# EAGLE design 7seg (EAGLE 4.16)
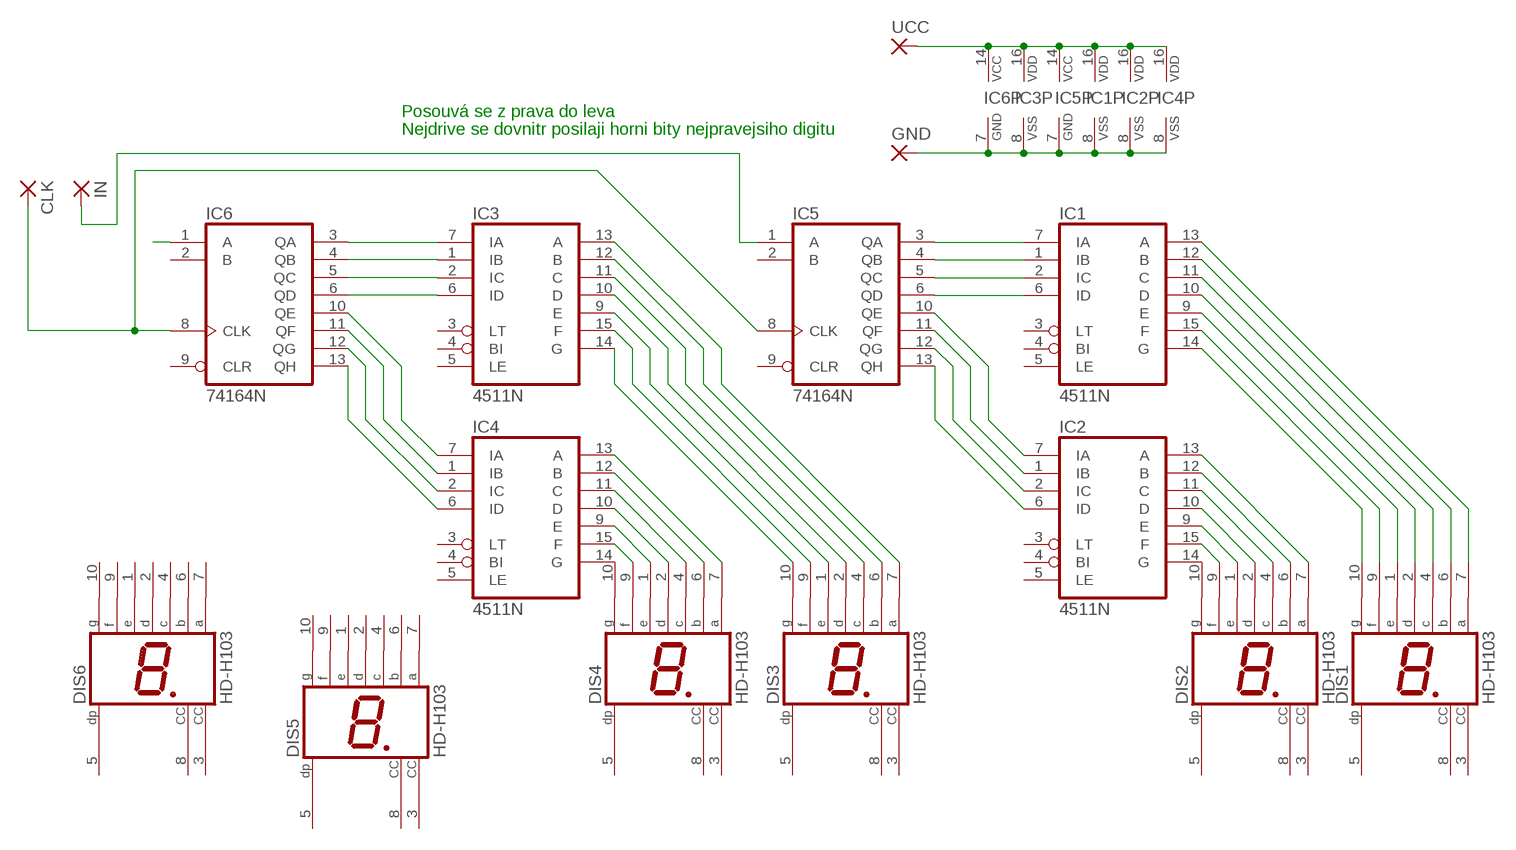
[diagram p0: schematic, sheet 1]

## Parts
CLK  2,54/0,8  [2,54/0,8]
DIS1  HD-H103  [HDSP-M]
DIS2  HD-H103  [HDSP-M]
DIS3  HD-H103  [HDSP-M]
DIS4  HD-H103  [HDSP-M]
DIS5  HD-H103  [HDSP-M]
DIS6  HD-H103  [HDSP-M]
GND  2,54/0,8  [2,54/0,8]
IC1  4511N  [DIL16]
IC2  4511N  [DIL16]
IC3  4511N  [DIL16]
IC4  4511N  [DIL16]
IC5  74164N  [DIL14]
IC6  74164N  [DIL14]
IN  2,54/0,8  [2,54/0,8]
UCC  2,54/0,8  [2,54/0,8]

## Nets
N$1: DIS2.10(G) IC2.14(G)
N$2: DIS2.9(F) IC2.15(F)
N$3: DIS2.1(E) IC2.9(E)
N$4: DIS2.2(D) IC2.10(D)
N$5: DIS2.4(C) IC2.11(C)
N$6: DIS2.6(B) IC2.12(B)
N$7: DIS2.7(A) IC2.13(A)
N$8: DIS1.10(G) IC1.14(G)
N$9: DIS1.9(F) IC1.15(F)
N$10: DIS1.1(E) IC1.9(E)
N$11: DIS1.2(D) IC1.10(D)
N$12: DIS1.4(C) IC1.11(C)
N$13: DIS1.7(A) IC1.13(A)
N$14: DIS1.6(B) IC1.12(B)
N$15: IC1.7(IA) IC5.3(QA)
N$16: IC1.1(IB) IC5.4(QB)
N$17: IC1.2(IC) IC5.5(QC)
N$18: IC1.6(ID) IC5.6(QD)
N$19: IC2.7(IA) IC5.10(QE)
N$20: IC2.1(IB) IC5.11(QF)
N$21: IC2.2(IC) IC5.12(QG)
N$22: IC2.6(ID) IC5.13(QH)
N$23: DIS4.10(G) IC4.14(G)
N$24: DIS4.9(F) IC4.15(F)
N$25: DIS4.1(E) IC4.9(E)
N$26: DIS4.2(D) IC4.10(D)
N$27: DIS4.4(C) IC4.11(C)
N$28: DIS4.6(B) IC4.12(B)
N$29: DIS4.7(A) IC4.13(A)
N$30: DIS3.10(G) IC3.14(G)
N$31: DIS3.9(F) IC3.15(F)
N$32: DIS3.1(E) IC3.9(E)
N$33: DIS3.2(D) IC3.10(D)
N$34: DIS3.4(C) IC3.11(C)
N$35: DIS3.6(B) IC3.12(B)
N$36: DIS3.7(A) IC3.13(A)
N$37: IC3.7(IA) IC6.3(QA)
N$38: IC3.1(IB) IC6.4(QB)
N$39: IC3.2(IC) IC6.5(QC)
N$40: IC3.6(ID) IC6.6(QD)
N$41: IC4.7(IA) IC6.10(QE)
N$42: IC4.1(IB) IC6.11(QF)
N$43: IC4.2(IC) IC6.12(QG)
N$44: IC4.6(ID) IC6.13(QH)
N$45: CLK.1(P) IC5.8(CLK) IC6.8(CLK)
N$46: IC6.1(A)
N$47: IC5.1(A) IN.1(P)
N$48: IC1.16(VDD) IC2.16(VDD) IC3.16(VDD) IC4.16(VDD) IC5.14(VCC) IC6.14(VCC) UCC.1(P)
N$49: GND.1(P) IC1.8(VSS) IC2.8(VSS) IC3.8(VSS) IC4.8(VSS) IC5.7(GND) IC6.7(GND)
Unconnected: DIS1.3(CC) DIS1.5(DP) DIS1.8(CC) DIS2.3(CC) DIS2.5(DP) DIS2.8(CC) DIS3.3(CC) DIS3.5(DP) DIS3.8(CC) DIS4.3(CC) DIS4.5(DP) DIS4.8(CC) DIS5.1(E) DIS5.2(D) DIS5.3(CC) DIS5.4(C) DIS5.5(DP) DIS5.6(B) DIS5.7(A) DIS5.8(CC) DIS5.9(F) DIS5.10(G) DIS6.1(E) DIS6.2(D) DIS6.3(CC) DIS6.4(C) DIS6.5(DP) DIS6.6(B) DIS6.7(A) DIS6.8(CC) DIS6.9(F) DIS6.10(G) IC1.3(LT) IC1.4(BI) IC1.5(LE) IC2.3(LT) IC2.4(BI) IC2.5(LE) IC3.3(LT) IC3.4(BI) IC3.5(LE) IC4.3(LT) IC4.4(BI) IC4.5(LE) IC5.2(B) IC5.9(CLR) IC6.2(B) IC6.9(CLR)

## Notes on the sheet
- Posouvá se z prava do leva
- Nejdrive se dovnitr posilaji horni bity nejpravejsiho digitu

## Library data of the parts
CLK GND IN UCC = wirepad:2,54/0,8: THROUGH-HOLE PAD
DIS1-DIS6 = display-hp:HD-H103: LED DISPLAY 1-character 7 segment, decimal point right
IC1-IC4 = 45xx:4511: BCD to 7-segment LATCH/DECODER/DRIVER
IC5 IC6 = 74xx-eu:74*164: 8-bit parallel out SHIFT REGISTER

## Board
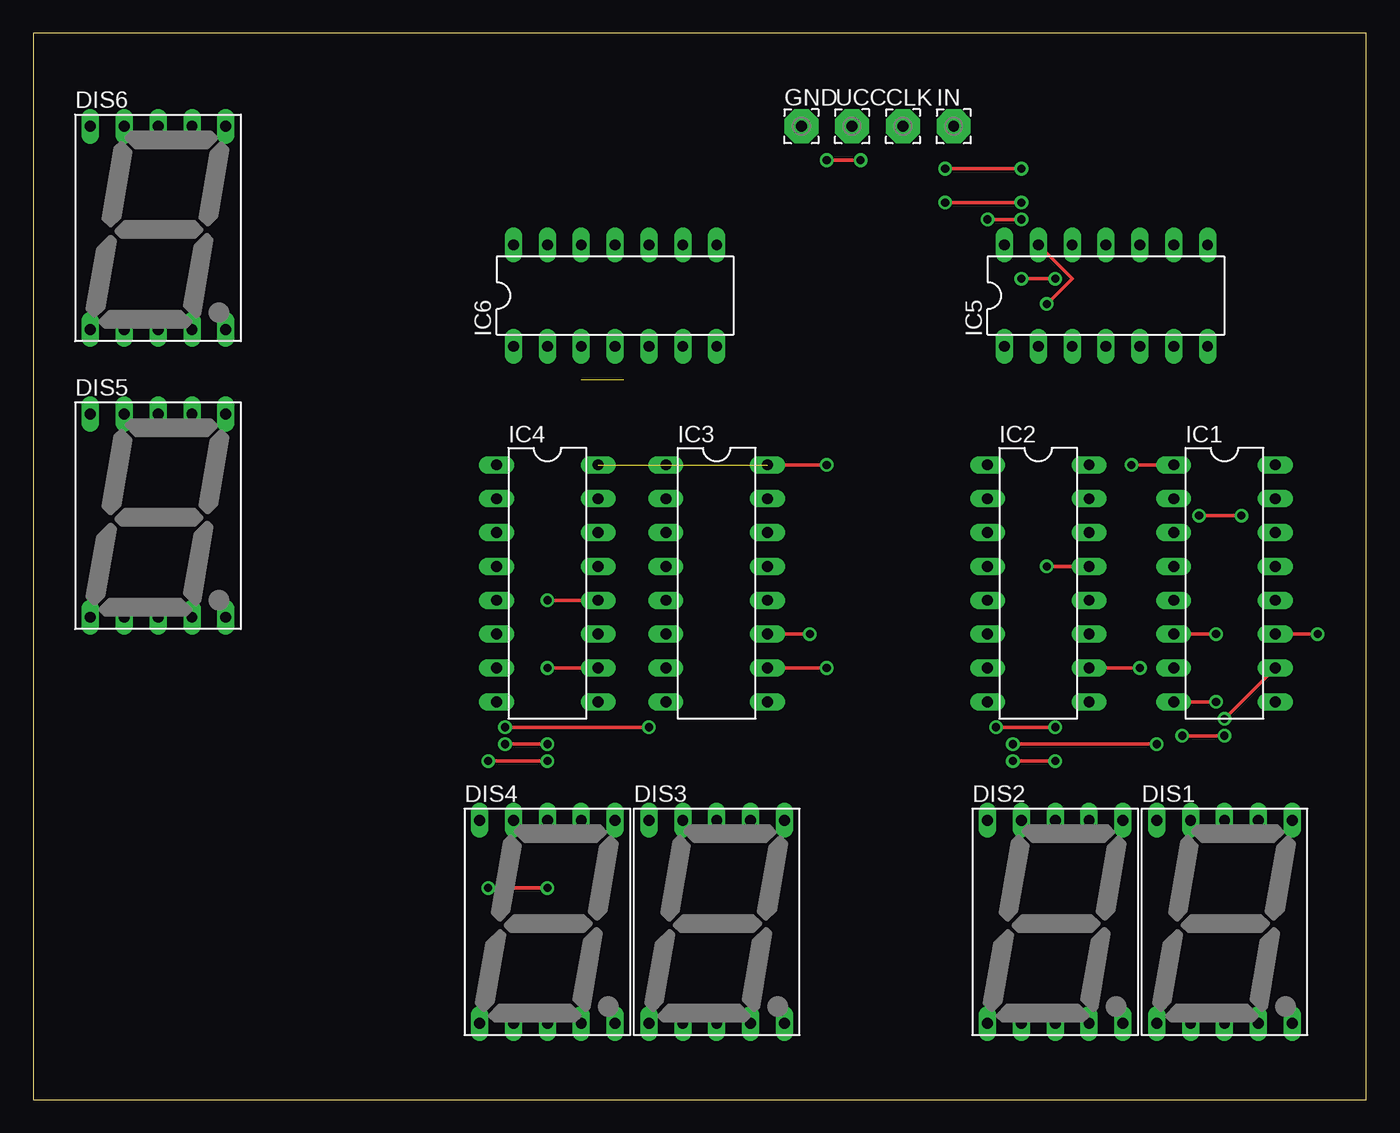
[diagram p1: board, top side]
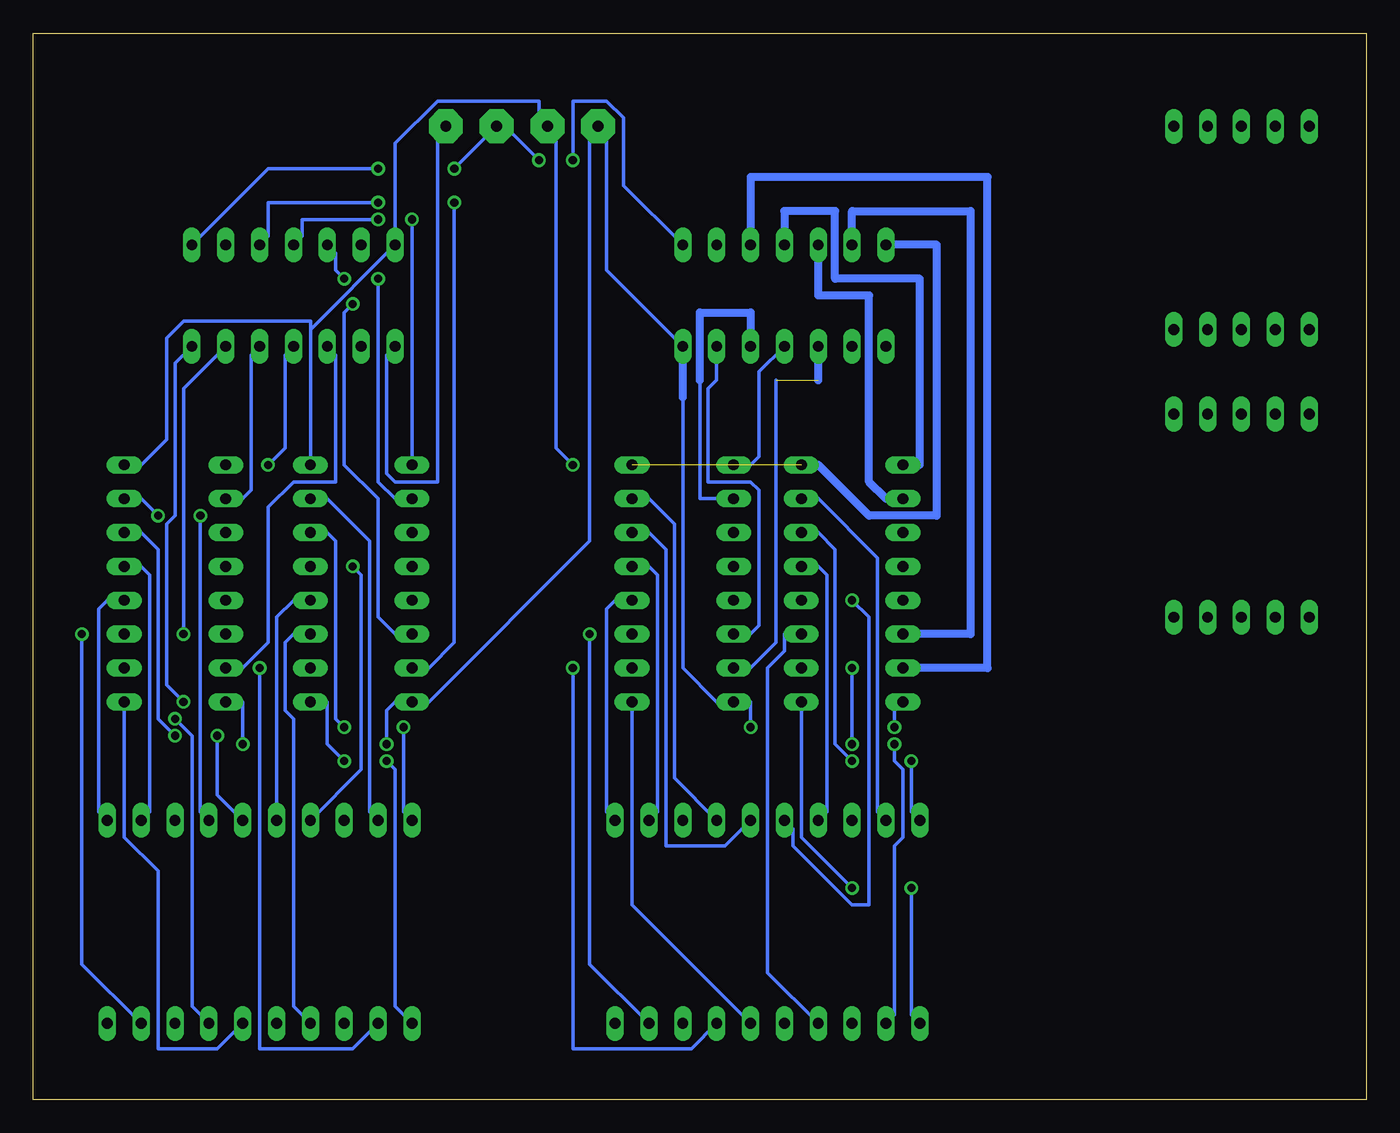
[diagram p2: board, bottom side, seen from below]

Size 100 x 80 mm. Coordinates in mm from the lower left corner, seen from the top.
Outline: 0,0 100,0 100,80 0,80 0,0
Copper layers (1*16): Top 0.035mm / dielectric 1.5mm / Bottom 0.035mm
Design rules "default": minimum track width 10mil, minimum drill 24mil, track to track 8mil, track to pad 8mil, pad to pad 8mil, via to via 8mil, smd to smd 8mil, copper to edge 40mil, drill to drill 8mil, minimum pad ring 10mil, minimum via ring 8mil, stop-mask expansion 4mil, vias tented up to drill 0mil, thermal gap 10mil

### Footprints (pad centres in the part's own frame; a part is rotated, then mirrored left to right if it is on the bottom)
2,54/0,8 = drill 0.813 pad 2.54 octagon: 1 0,0
HDSP-M = drill 0.813 long: 1 -5.08,-7.62; 2 -2.54,-7.62; 3 0,-7.62; 4 2.54,-7.62; 5 5.08,-7.62; 6 5.08,7.62; 7 2.54,7.62; 8 0,7.62; 9 -2.54,7.62; 10 -5.08,7.62
DIL16 = drill 0.813 long: 1 -8.89,-3.81; 2 -6.35,-3.81; 3 -3.81,-3.81; 4 -1.27,-3.81; 5 1.27,-3.81; 6 3.81,-3.81; 7 6.35,-3.81; 8 8.89,-3.81; 9 8.89,3.81; 10 6.35,3.81; 11 3.81,3.81; 12 1.27,3.81; 13 -1.27,3.81; 14 -3.81,3.81; 15 -6.35,3.81; 16 -8.89,3.81
DIL14 = drill 0.813 long: 1 -7.62,-3.81; 2 -5.08,-3.81; 3 -2.54,-3.81; 4 0,-3.81; 5 2.54,-3.81; 6 5.08,-3.81; 7 7.62,-3.81; 8 7.62,3.81; 9 5.08,3.81; 10 2.54,3.81; 11 0,3.81; 12 -2.54,3.81; 13 -5.08,3.81; 14 -7.62,3.81

### Placement (x,y rotation side)
CLK  65.24,73.02 0 top
DIS1  89.37,13.33 0 top
DIS2  76.67,13.33 0 top
DIS3  51.27,13.33 0 top
DIS4  38.57,13.33 0 top
DIS5  9.36,43.81 0 top
DIS6  9.36,65.4 0 top
GND  57.62,73.02 0 top
IC1  89.37,38.73 270 top
IC2  75.4,38.73 270 top
IC3  51.27,38.73 270 top
IC4  38.57,38.73 270 top
IC5  80.48,60.32 0 top
IC6  43.65,60.32 0 top
IN  69.05,73.02 0 top
UCC  61.43,73.02 0 top

### Tracks (layer width: path | path; a pad name or v marks a point on that pad's centre or on a via)
N$1  (via drill 0.61)
  Top 0.254: v72.22,27.93 v76.67,27.93
  Bottom 0.254: v72.22,27.93 72.22,21.58 DIS2.10 | v76.67,27.93 77.3,28.57 77.3,41.91 77.94,42.54 IC2.14
N$2
  Bottom 0.254: DIS2.9 74.77,21.58 74.77,41.91 77.94,45.08 IC2.15
N$3  (via drill 0.61)
  Top 0.254: v73.5,25.39 v76.67,25.39
  Bottom 0.254: v73.5,25.39 72.86,24.76 72.86,6.98 DIS2.1 | v76.67,25.39 77.94,26.66 77.94,29.84 IC2.9
N$4  (via drill 0.61)
  Top 0.254: v83.02,32.38 IC2.10
  Bottom 0.254: v83.02,32.38 83.02,3.8 76.03,3.8 DIS2.2
N$5
  Bottom 0.254: DIS2.4 80.48,6.98 80.48,28.57 81.11,29.2 81.11,34.29 80.48,34.92 IC2.11
N$6
  Bottom 0.254: DIS2.6 81.75,36.19 80.48,37.46 IC2.12
N$7  (via drill 0.61)
  Top 0.254: v76.03,40 IC2.13
  Bottom 0.254: v76.03,40 75.4,39.37 75.4,24.76 DIS2.7
N$8  (via drill 0.61)
  Top 0.254: v86.19,27.3 v89.37,27.3
  Bottom 0.254: v86.19,27.3 86.19,22.86 DIS1.10 | v89.37,27.3 90.64,28.57 90.64,41.27 91.91,42.54 IC1.14
N$9  (via drill 0.61)
  Top 0.254: v87.47,43.81 v90.64,43.81
  Bottom 0.254: v87.47,43.81 87.47,21.58 DIS1.9 | v90.64,43.81 91.91,45.08 IC1.15
N$10
  Bottom 0.254: DIS1.1 86.19,3.8 90.64,3.8 90.64,17.14 93.18,19.68 IC1.9
N$11  (via drill 0.61)
  Top 0.254: v89.37,28.57 IC1.10
  Bottom 0.254: v89.37,28.57 88.1,27.3 88.1,6.98 DIS1.2
N$12  (via drill 0.61)
  Top 0.254: v96.36,34.92 IC1.11
  Bottom 0.254: v96.36,34.92 96.36,10.16 DIS1.4
N$13
  Bottom 0.254: DIS1.7 91.28,21.58 91.28,39.37 91.91,40 IC1.13
N$14
  Bottom 0.254: DIS1.6 95.08,21.58 95.08,36.83 94.45,37.46 IC1.12
N$15
  Bottom 0.254: IC1.7 84.29,32.38 82.39,34.29 82.39,44.45 80.48,46.35 77.3,46.35 77.3,55.88 IC5.3
N$16  (via drill 0.61)
  Top 0.254: v82.39,47.62 IC1.1
  Bottom 0.254: v82.39,47.62 81.11,48.89 81.11,55.88 IC5.4
N$17
  Bottom 0.254: IC1.2 84.29,45.08 83.66,45.72 83.66,55.88 IC5.5
N$18  (via drill 0.61)
  Top 0.254: IC1.6 v88.73,34.92
  Bottom 0.254: v88.73,34.92 88.73,53.34 IC5.6
N$19  (via drill 0.61)
  Top 0.254: v68.41,67.3 v74.13,67.3
  Bottom 0.254: v68.41,67.3 68.41,34.29 70.32,32.38 IC2.7 | v74.13,67.3 82.39,67.3 82.39,64.77 IC5.10
N$20  (via drill 0.61)
  Top 0.254: v71.59,66.03 v74.13,66.03
  Bottom 0.254: v74.13,66.03 79.84,66.03 79.84,64.77 IC5.11 | IC2.1 v71.59,66.03
N$21  (via drill 0.61)
  Top 0.254: v74.13,61.59 v76.67,61.59
  Bottom 0.254: v74.13,61.59 74.13,46.35 72.86,45.08 IC2.2 | v76.67,61.59 77.3,62.23 77.3,63.5 IC5.12
N$22  (via drill 0.61)
  Top 0.254: v76.03,59.69 77.94,61.59 IC5.13
  Bottom 0.254: v76.03,59.69 76.67,59.05 76.67,47.62 74.13,45.08 74.13,36.19 72.86,34.92 IC2.6
N$23  (via drill 0.61)
  Top 0.254: v34.12,25.39 v38.57,25.39
  Bottom 0.254: v34.12,25.39 34.12,21.58 DIS4.10 | v38.57,25.39 39.84,26.66 39.84,41.27 41.11,42.54 IC4.14
N$24
  Bottom 0.254: DIS4.9 36.66,21.58 36.66,40.64 41.11,45.08 IC4.15
N$25  (via drill 0.61)
  Top 0.254: v34.12,15.87 v38.57,15.87
  Bottom 0.254: v34.12,15.87 34.12,6.34 DIS4.1 | v38.57,15.87 42.38,19.68 IC4.9
N$26  (via drill 0.61)
  Top 0.254: v35.39,26.66 v38.57,26.66 | v38.57,32.38 IC4.10
  Bottom 0.254: v35.39,26.66 35.39,25.39 34.76,24.76 34.76,19.68 35.39,19.04 35.39,6.34 DIS4.2 | v38.57,26.66 v38.57,32.38
N$27
  Bottom 0.254: DIS4.4 44.92,9.52 44.92,32.38 43.65,33.65 43.65,34.92 IC4.11
N$28  (via drill 0.61)
  Top 0.254: v38.57,37.46 IC4.12
  Bottom 0.254: v38.57,37.46 37.3,36.19 37.3,14.6 38.57,14.6 43.02,19.04 43.02,20.31 DIS4.6
N$29
  Bottom 0.254: DIS4.7 40.48,21.58 40.48,39.37 41.11,40 IC4.13
N$30
  Bottom 0.254: DIS3.10 48.09,19.04 52.54,19.04 52.54,41.27 53.81,42.54 IC3.14
N$31
  Bottom 0.254: DIS3.9 51.91,24.12 51.91,43.18 53.81,45.08 IC3.15
N$32
  Bottom 0.254: DIS3.1 55.08,14.6 IC3.9
N$33  (via drill 0.61)
  Top 0.254: v59.52,32.38 IC3.10
  Bottom 0.254: v59.52,32.38 59.52,3.8 50.63,3.8 DIS3.2
N$34  (via drill 0.61)
  Top 0.254: v58.25,34.92 IC3.11
  Bottom 0.254: v58.25,34.92 58.25,10.16 DIS3.4
N$35
  Bottom 0.254: DIS3.6 56.98,21.58 56.98,36.83 56.35,37.46 IC3.12
N$36
  Bottom 0.254: DIS3.7 53.17,21.58 53.17,39.37 53.81,40 IC3.13
N$37  (1 unrouted)
  Bottom 0.254: 44.28,53.97 44.28,34.29 46.19,32.38 IC3.7
  Bottom 0.61: 41.11,53.97 IC6.3
N$38
  Bottom 0.254: IC3.1 46.19,47.62 45.55,48.26 45.55,54.61 IC6.4
N$39
  Bottom 0.254: 50,53.97 50,45.08 IC3.2
  Bottom 0.61: IC6.5 46.19,59.05 50,59.05 50,53.97
N$40
  Bottom 0.254: IC3.6 46.19,34.92 45.55,35.55 45.55,45.72 46.19,46.35 49.37,46.35 49.37,53.34 48.73,53.97 IC6.6
N$41
  Bottom 0.61: IC6.10 46.19,69.21 28.41,69.21 28.41,32.38 IC4.7
N$42
  Bottom 0.61: IC6.11 43.65,66.67 39.84,66.67 39.84,61.59 33.49,61.59 33.49,47.62 IC4.1
N$43
  Bottom 0.61: IC4.2 36.03,45.08 37.3,46.35 37.3,60.32 41.11,60.32 IC6.12
N$44
  Bottom 0.61: IC6.13 38.57,66.67 29.68,66.67 29.68,34.92 IC4.6
N$45  (via drill 0.61)
  Top 0.254: v59.52,70.48 v62.06,70.48 | v68.41,69.84 v74.13,69.84
  Bottom 0.254: v59.52,70.48 59.52,74.92 56.98,74.92 55.71,73.66 55.71,68.57 IC6.8 | v62.06,70.48 64.61,73.02 CLK.1 v68.41,69.84 | v74.13,69.84 82.39,69.84 IC5.8
N$47
  Bottom 0.254: IC5.1 73.5,55.88 73.5,46.98 72.86,46.35 69.69,46.35 69.69,72.38 IN.1
N$48  (via drill 0.61)  (1 unrouted)
  Top 0.254: IC3.16 v59.52,47.62
  Bottom 0.254: 79.21,57.78 IC2.16 | 79.21,57.78 IC5.14 72.86,71.75 69.69,74.92 62.06,74.92 62.06,73.66 UCC.1 60.8,72.38 60.8,48.89 v59.52,47.62 | 79.21,57.78 79.21,58.41 88.73,58.41 90,57.15 90,49.53 91.91,47.62 IC1.16
  Bottom 0.61: IC6.14 32.22,64.13 32.22,43.81 37.3,43.81 41.11,47.62 IC4.16
N$49  (via drill 0.61)
  Top 0.254: IC1.8 v88.73,29.84 | v35.39,27.93 v46.19,27.93 | v73.5,26.66 v84.29,26.66
  Bottom 0.254: v88.73,29.84 90,31.11 90,43.18 89.37,43.81 89.37,55.24 IC5.7 | v35.39,27.93 35.39,29.2 IC4.8 | v46.19,27.93 46.19,29.84 IC3.8 48.73,29.84 51.27,32.38 51.27,52.7 | IC6.7 56.98,62.23 56.98,72.38 GND.1 58.25,72.38 58.25,41.91 70.32,29.84 IC2.8 72.86,29.84 73.5,29.2 v73.5,26.66 | v84.29,26.66 84.29,29.84 IC1.8
  Bottom 0.61: 51.27,52.7 IC6.7